# Altium schematic sheet Disp&Eye.SchDoc
size A4
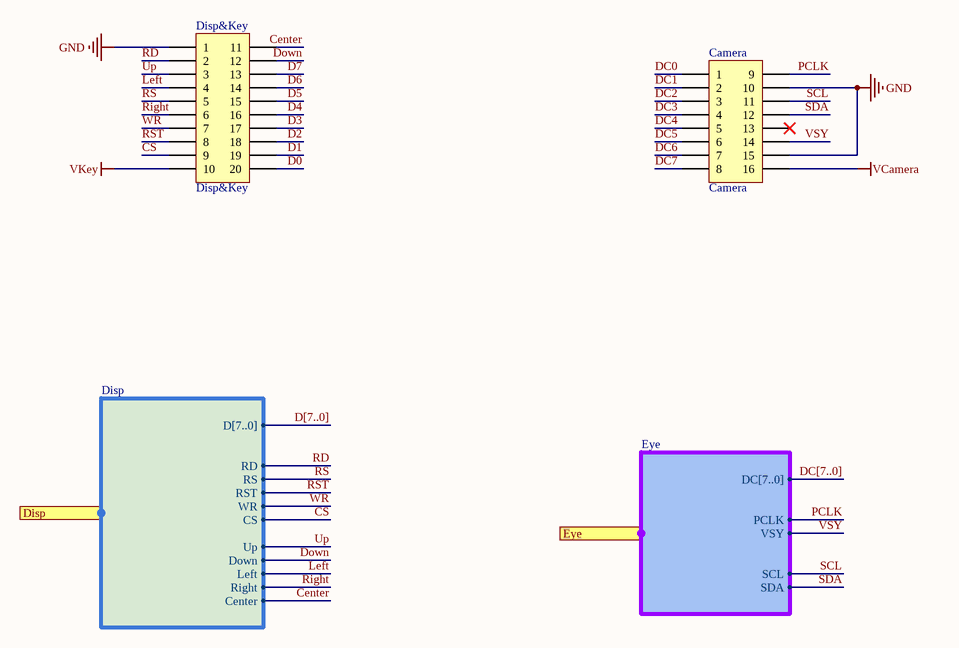
[diagram p0: Disp&Eye.SchDoc]

## Parts
Camera  Camera  [HDR2X8_CEN]
Disp&Key  Disp&Key  [HDR2X10_CEN]

## Ports
Disp (harness Disp), Eye (harness Eye)

## Harnesses
Disp: D[7..0], RD, RS, RST, WR, Up, Down, Left, Right, Center, CS
Eye: DC[7..0], PCLK, VSY, SCL, SDA

## Nets
GND: Camera.10 Camera.15 Disp&Key.1
VCamera: Camera.16
VKey: Disp&Key.10
Center: Disp&Key.11 ; port Disp.Center
CS: Disp&Key.9 ; port Disp.CS
D0: Disp&Key.20
D1: Disp&Key.19
D2: Disp&Key.18
D3: Disp&Key.17
D4: Disp&Key.16
D5: Disp&Key.15
D6: Disp&Key.14
D7: Disp&Key.13
DC0: Camera.1
DC1: Camera.2
DC2: Camera.3
DC3: Camera.4
DC4: Camera.5
DC5: Camera.6
DC6: Camera.7
DC7: Camera.8
Down: Disp&Key.12 ; port Disp.Down
Left: Disp&Key.4 ; port Disp.Left
PCLK: Camera.9 ; port Eye.PCLK
RD: Disp&Key.2 ; port Disp.RD
Right: Disp&Key.6 ; port Disp.Right
RS: Disp&Key.5 ; port Disp.RS
RST: Disp&Key.8 ; port Disp.RST
SCL: Camera.11 ; port Eye.SCL
SDA: Camera.12 ; port Eye.SDA
Up: Disp&Key.3 ; port Disp.Up
VSY: Camera.14 ; port Eye.VSY
WR: Disp&Key.7 ; port Disp.WR

Not connected (* = marked no-connect by the designer): Camera 13*

## Buses and harness runs
bus D[7..0]
bus DC[7..0]

## Library data of the parts
Camera = Header 8X2A: Header, 8-Pin, Dual row; LatestRevisionDate: 17-Jul-2002; LatestRevisionNote: Re-released for DXP Platform.; Publisher: Altium Limited
Disp&Key = Header 10X2A: Header, 10-Pin, Dual row; LatestRevisionDate: 17-Jul-2002; LatestRevisionNote: Re-released for DXP Platform.; Publisher: Altium Limited